# Altium schematic sheet PICMX340F512H.SchDoc
size A4; SheetNumber: 1
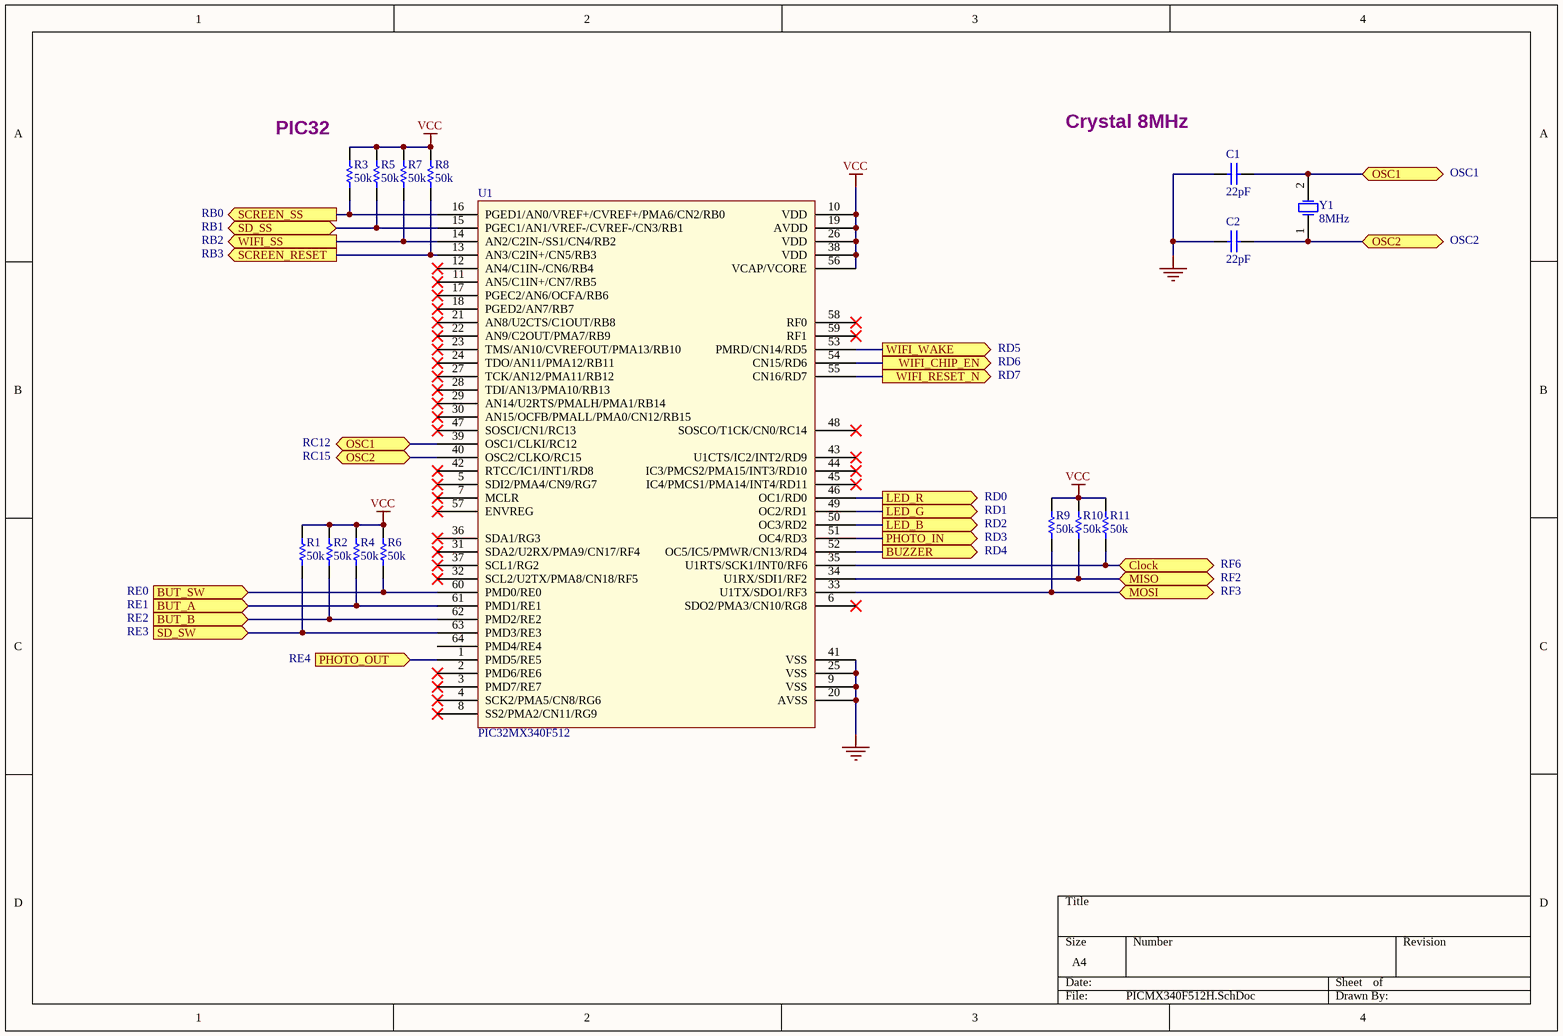
[diagram p0: PICMX340F512H.SchDoc]

## Parts
C1  22pF  [CAPC1608X90N]
C2  22pF  [CAPC1608X90N]
R1  50k  [RESC1608X55N]
R2  50k  [RESC1608X55N]
R3  50k  [RESC1608X55N]
R4  50k  [RESC1608X55N]
R5  50k  [RESC1608X55N]
R6  50k  [RESC1608X55N]
R7  50k  [RESC1608X55N]
R8  50k  [RESC1608X55N]
R9  50k  [RESC1608X55N]
R10  50k  [RESC1608X55N]
R11  50k  [RESC1608X55N]
U1  PIC32MX340F512
Y1  8MHz  [XTAL139X50X45]

## Ports
BUT_A (in), BUT_B (in), BUT_SW (in), BUZZER (out), Clock (bidir), LED_B (out), LED_G (out), LED_R (out), MISO (bidir), MOSI (bidir), OSC1 (bidir), OSC2 (bidir), PHOTO_IN (out), PHOTO_OUT (in), SCREEN_RESET (out), SCREEN_SS (out), SD_SS (bidir), SD_SW (in), WIFI_CHIP_EN (out), WIFI_RESET_N (out), WIFI_SS (out), WIFI_WAKE (out)

## Nets
GND: C1.2 C2.2 U1.9(VSS) U1.20(AVSS) U1.25(VSS) U1.41(VSS)
VCC: R1.2 R2.2 R3.2 R4.2 R5.2 R6.2 R7.2 R8.2 R9.2 R10.2 R11.2 U1.10(VDD) U1.19(AVDD) U1.26(VDD) U1.38(VDD) U1.56(VCAP/VCORE)
BUT_A: R4.1 U1.61(PMD1/RE1) ; port BUT_A
BUT_B: R2.1 U1.62(PMD2/RE2) ; port BUT_B
BUT_SW: R6.1 U1.60(PMD0/RE0) ; port BUT_SW
BUZZER: U1.52(OC5/IC5/PMWR/CN13/RD4) ; port BUZZER
Clock: R11.1 U1.35(U1RTS/SCK1/INT0/RF6) ; port Clock
LED_B: U1.50(OC3/RD2) ; port LED_B
LED_G: U1.49(OC2/RD1) ; port LED_G
LED_R: U1.46(OC1/RD0) ; port LED_R
MISO: R10.1 U1.34(U1RX/SDI1/RF2) ; port MISO
MOSI: R9.1 U1.33(U1TX/SDO1/RF3) ; port MOSI
OSC1: C1.1 U1.39(OSC1/CLKI/RC12) Y1.2(OSC2) ; port OSC1
OSC2: C2.1 U1.40(OSC2/CLKO/RC15) Y1.1(OSC1) ; port OSC2
PHOTO_IN: U1.51(OC4/RD3) ; port PHOTO_IN
PHOTO_OUT: U1.1(PMD5/RE5) ; port PHOTO_OUT
SCREEN_RESET: R8.1 U1.13(AN3/C2IN+/CN5/RB3) ; port SCREEN_RESET
SCREEN_SS: R3.1 U1.16(PGED1/AN0/VREF+/CVREF+/PMA6/CN2/RB0) ; port SCREEN_SS
SD_SS: R5.1 U1.15(PGEC1/AN1/VREF-/CVREF-/CN3/RB1) ; port SD_SS
SD_SW: R1.1 U1.63(PMD3/RE3) ; port SD_SW
WIFI_CHIP_EN: U1.54(CN15/RD6) ; port WIFI_CHIP_EN
WIFI_RESET_N: U1.55(CN16/RD7) ; port WIFI_RESET_N
WIFI_SS: R7.1 U1.14(AN2/C2IN-/SS1/CN4/RB2) ; port WIFI_SS
WIFI_WAKE: U1.53(PMRD/CN14/RD5) ; port WIFI_WAKE

Not connected (* = marked no-connect by the designer): U1 2(PMD6/RE6)* 3(PMD7/RE7)* 4(SCK2/PMA5/CN8/RG6)* 5(SDI2/PMA4/CN9/RG7)* 6(SDO2/PMA3/CN10/RG8)* 7(MCLR)* 8(SS2/PMA2/CN11/RG9)* 11(AN5/C1IN+/CN7/RB5)* 12(AN4/C1IN-/CN6/RB4)* 17(PGEC2/AN6/OCFA/RB6)* 18(PGED2/AN7/RB7)* 21(AN8/U2CTS/C1OUT/RB8)* 22(AN9/C2OUT/PMA7/RB9)* 23(TMS/AN10/CVREFOUT/PMA13/RB10)* 24(TDO/AN11/PMA12/RB11)* 27(TCK/AN12/PMA11/RB12)* 28(TDI/AN13/PMA10/RB13)* 29(AN14/U2RTS/PMALH/PMA1/RB14)* 30(AN15/OCFB/PMALL/PMA0/CN12/RB15)* 31(SDA2/U2RX/PMA9/CN17/RF4)* 32(SCL2/U2TX/PMA8/CN18/RF5)* 36(SDA1/RG3)* 37(SCL1/RG2)* 42(RTCC/IC1/INT1/RD8)* 43(U1CTS/IC2/INT2/RD9)* 44(IC3/PMCS2/PMA15/INT3/RD10)* 45(IC4/PMCS1/PMA14/INT4/RD11)* 47(SOSCI/CN1/RC13)* 48(SOSCO/T1CK/CN0/RC14)* 57(ENVREG)* 58(RF0)* 59(RF1)* 64(PMD4/RE4)

## Notes on the sheet
- (near R3) PIC32
- Crystal 8MHz
- OSC1
- RB0
- RB1
- RB2
- OSC2
- RB3
- RD5
- RD6
- RD7
- RC12
- RC15
- RD0
- RD1
- RD2
- RD3
- RD4
- RF6
- RF2
- RE0
- RE1
- RE2
- RE3
- RF3
- RE4

## Library data of the parts
C1 C2 = Capacitor: Fournisseur: Farnell; Value: 22pF
R1-R11 = Resistor: Value: 1K; Published: 8-Jun-2000; LatestRevisionDate: 17-Jul-2002; LatestRevisionNote: Re-released for DXP Platform.; PackageReference: AXIAL-0.3; Publisher: Altium Limited; PackageDescription: Axial Device, Thru-Hole; 2 Leads; 0.3 in Pin Spacing
U1 = PIC32MX340F512H: Protoboard_pic; Fabricant: MICROCHIP; Fournisseur: Farnell; REF_Fournisseur: 2775021; REF_Fabricant: PIC32MX174F256B-I/SO
Y1 = Crystal: Crystal Oscillator; Fabricant: TXC; Fournisseur: Farnell; REF_Fournisseur: 1842347; REF_Fabricant: 9C-8.000MEEJ-T; Value: 8MHz